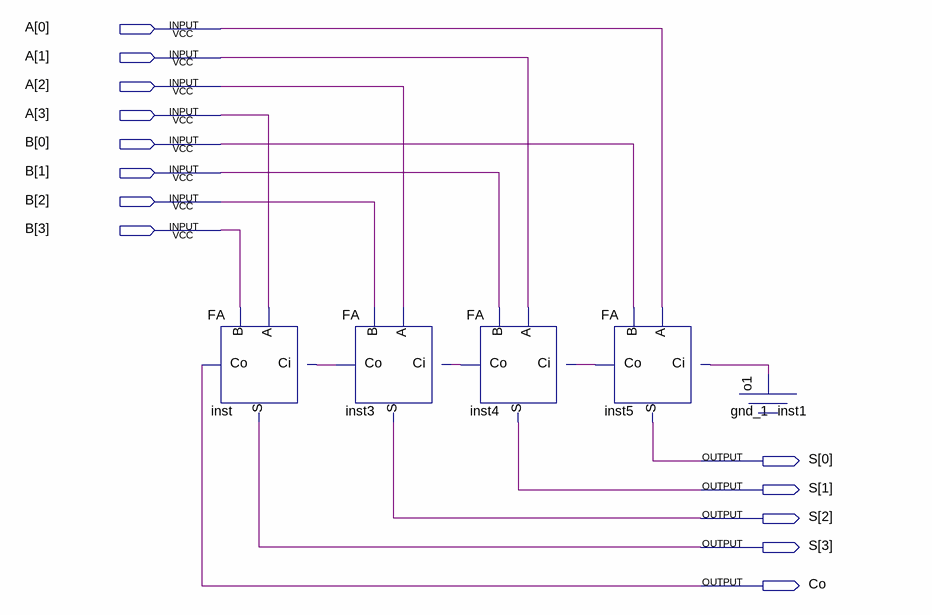
[diagram p0: schematic sheet]
// Quartus schematic FA4.bdf as structural Verilog: 5 symbols, 13 pins
module FA4 (
  input  [3:0] A,
  input  [3:0] B,
  output [3:0] S,
  output Co
);

  wire inst1_o1, inst3_co, inst4_co, inst5_co;

  FA inst (.A(A[3]), .B(B[3]), .Ci(inst3_co), .S(S[3]), .Co(Co));
  FA inst3 (.A(A[2]), .B(B[2]), .Ci(inst4_co), .S(S[2]), .Co(inst3_co));
  FA inst4 (.A(A[1]), .B(B[1]), .Ci(inst5_co), .S(S[1]), .Co(inst4_co));
  FA inst5 (.A(A[0]), .B(B[0]), .Ci(inst1_o1), .S(S[0]), .Co(inst5_co));
  gnd_1 inst1 (.o1(inst1_o1));
endmodule
